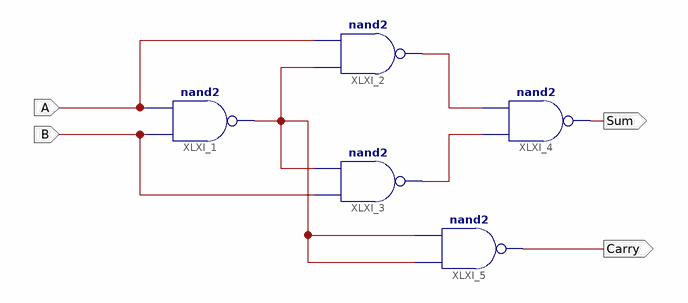
[diagram p0: schematic sheet 1]
// Xilinx ISE schematic Lab4Exp3HA.sch (spartan3e) as structural Verilog: 5 symbols, 4 ports
module Lab4Exp3HA (
  input  B,
  input  A,
  output Sum,
  output Carry
);

  wire XLXN_6, XLXN_10, XLXN_11;

  nand XLXI_1 (XLXN_6, B, A);
  nand XLXI_2 (XLXN_10, XLXN_6, A);
  nand XLXI_3 (XLXN_11, B, XLXN_6);
  nand XLXI_4 (Sum, XLXN_11, XLXN_10);
  nand XLXI_5 (Carry, XLXN_6, XLXN_6);
endmodule
